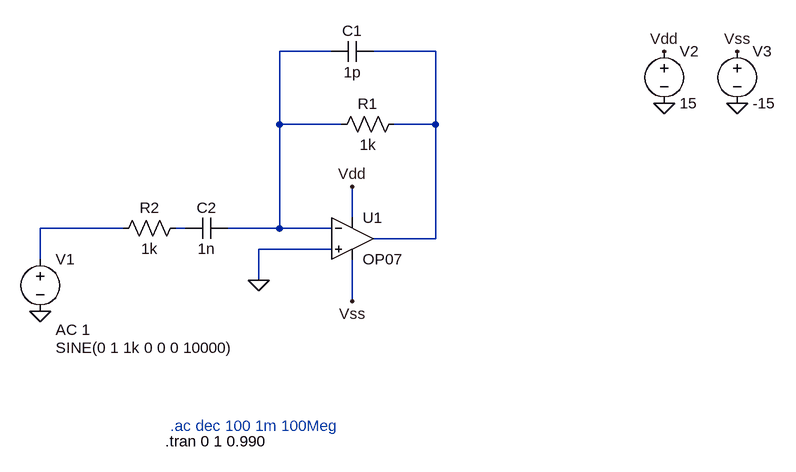
[diagram p0: schematic 1g.asc]
1g.asc, the LTspice schematic file:
Version 4.1
SHEET 1 880 680
WIRE 128 -144 48 -144
WIRE 288 -144 192 -144
WIRE 48 -32 48 -144
WIRE 144 -32 48 -32
WIRE 288 -32 288 -144
WIRE 288 -32 224 -32
WIRE 160 112 160 64
WIRE -192 128 -320 128
WIRE -96 128 -112 128
WIRE 48 128 48 -32
WIRE 48 128 -32 128
WIRE 128 128 48 128
WIRE 288 144 288 -32
WIRE 288 144 192 144
WIRE 128 160 16 160
WIRE -320 176 -320 128
WIRE 16 208 16 160
WIRE 160 240 160 176
FLAG 640 -64 0
FLAG 752 -64 0
FLAG 640 -144 Vdd
FLAG 752 -144 Vss
FLAG 160 64 Vdd
FLAG 160 240 Vss
FLAG -320 256 0
FLAG 16 208 0
SYMBOL voltage 640 -160 R0
SYMATTR InstName V2
SYMATTR Value 15
SYMBOL voltage 752 -160 R0
SYMATTR InstName V3
SYMATTR Value -15
SYMBOL OpAmps\\OP07 160 80 R0
SYMATTR InstName U1
SYMBOL res 240 -48 R90
WINDOW 0 0 56 VBottom 2
WINDOW 3 32 56 VTop 2
SYMATTR InstName R1
SYMATTR Value 1k
SYMBOL voltage -320 160 R0
WINDOW 3 24 152 Left 2
WINDOW 123 24 124 Left 2
WINDOW 39 0 0 Left 0
SYMATTR InstName V1
SYMATTR Value SINE(0 1 1k 0 0 0 10000)
SYMATTR Value2 AC 1
SYMBOL cap 192 -160 R90
WINDOW 0 0 32 VBottom 2
WINDOW 3 32 32 VTop 2
SYMATTR InstName C1
SYMATTR Value 1p
SYMBOL cap -32 112 R90
WINDOW 0 0 32 VBottom 2
WINDOW 3 32 32 VTop 2
SYMATTR InstName C2
SYMATTR Value 1n
SYMBOL res -96 112 R90
WINDOW 0 0 56 VBottom 2
WINDOW 3 32 56 VTop 2
SYMATTR InstName R2
SYMATTR Value 1k
TEXT -128 456 Left 2 !.tran 0 1 0.990
TEXT -120 432 Left 2 ;.ac dec 100 1m 100Meg

The netlist it stands for:
* 1g.asc
V2 Vdd 0 15
V3 Vss 0 -15
X§U1 0 N001 Vdd Vss N002 LT1001  ; OP07, pins In+ In- V+ V- OUT
R1 N002 N001 1k
V1 N003 0 SINE(0 1 1k 0 0 0 10000) AC 1
C1 N002 N001 1p
C2 N001 N004 1n
R2 N004 N003 1k
.tran 0 1 0.990
* .ac dec 100 1m 100Meg
.lib LTC.lib
.backanno
.end